# EAGLE design circuit0 (EAGLE 9.6.2)
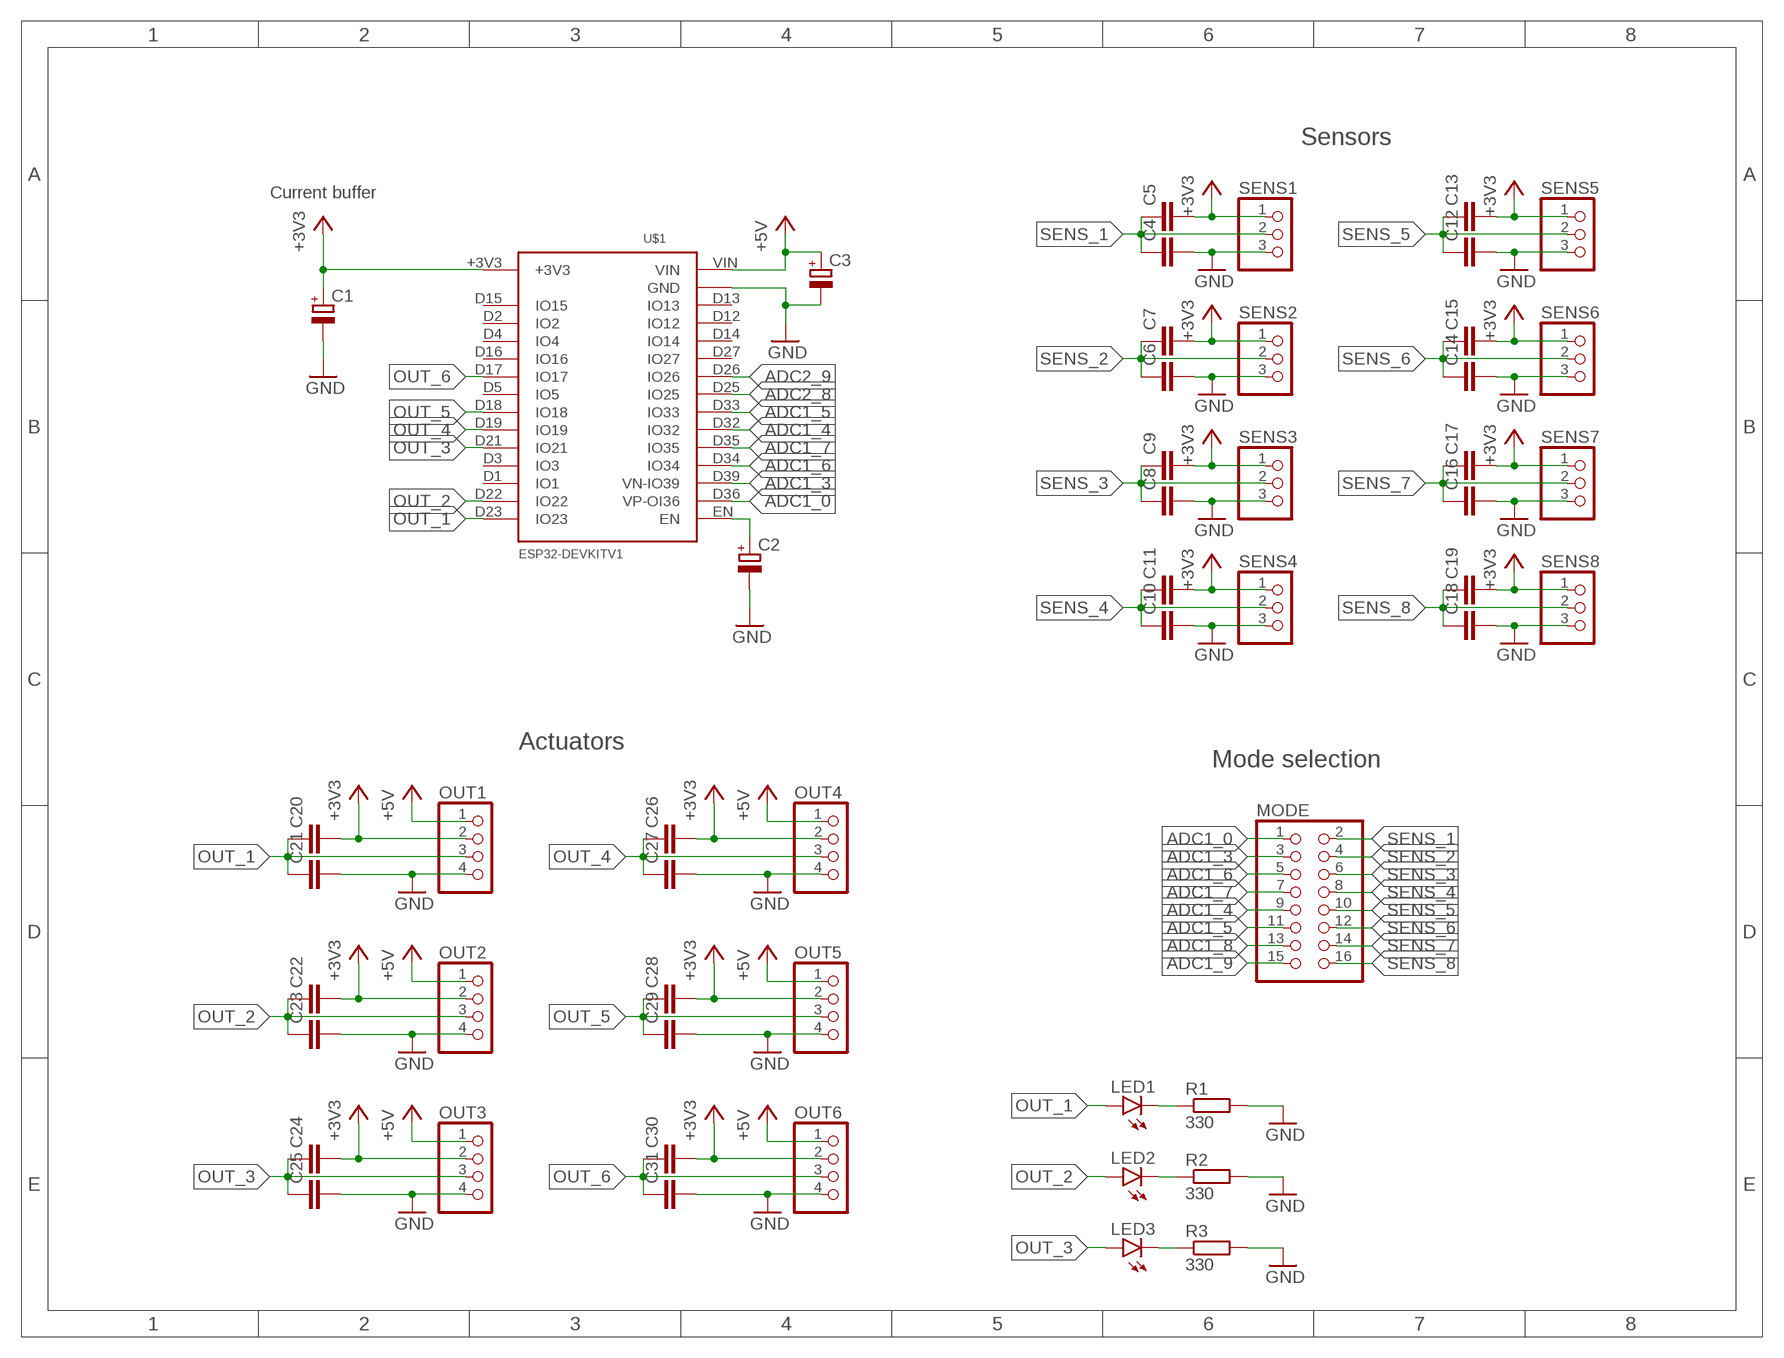
[diagram p0: schematic, sheet 1]

## Parts
C1  CPOL-EUE3.5-8  [E3,5-8]
C2  CPOL-EUE3.5-8  [E3,5-8]
C3  CPOL-EUE3.5-8  [E3,5-8]
C4  C-EU025-030X050  [C025-030X050]
C5  C-EU025-030X050  [C025-030X050]
C6  C-EU025-030X050  [C025-030X050]
C7  C-EU025-030X050  [C025-030X050]
C8  C-EU025-030X050  [C025-030X050]
C9  C-EU025-030X050  [C025-030X050]
C10  C-EU025-030X050  [C025-030X050]
C11  C-EU025-030X050  [C025-030X050]
C12  C-EU025-030X050  [C025-030X050]
C13  C-EU025-030X050  [C025-030X050]
C14  C-EU025-030X050  [C025-030X050]
C15  C-EU025-030X050  [C025-030X050]
C16  C-EU025-030X050  [C025-030X050]
C17  C-EU025-030X050  [C025-030X050]
C18  C-EU025-030X050  [C025-030X050]
C19  C-EU025-030X050  [C025-030X050]
C20  C-EU025-030X050  [C025-030X050]
C21  C-EU025-030X050  [C025-030X050]
C22  C-EU025-030X050  [C025-030X050]
C23  C-EU025-030X050  [C025-030X050]
C24  C-EU025-030X050  [C025-030X050]
C25  C-EU025-030X050  [C025-030X050]
C26  C-EU025-030X050  [C025-030X050]
C27  C-EU025-030X050  [C025-030X050]
C28  C-EU025-030X050  [C025-030X050]
C29  C-EU025-030X050  [C025-030X050]
C30  C-EU025-030X050  [C025-030X050]
C31  C-EU025-030X050  [C025-030X050]
LED1  LED3MM  [LED3MM]
LED2  LED3MM  [LED3MM]
LED3  LED3MM  [LED3MM]
MODE  PINHD-2X8  [2X08]
OUT1  PINHD-1X4  [1X04]
OUT2  PINHD-1X4  [1X04]
OUT3  PINHD-1X4  [1X04]
OUT4  PINHD-1X4  [1X04]
OUT5  PINHD-1X4  [1X04]
OUT6  PINHD-1X4  [1X04]
R1  330  R-EU_0204/7  [0204/7]
R2  330  R-EU_0204/7  [0204/7]
R3  330  R-EU_0204/7  [0204/7]
SENS1  PINHD-1X3  [1X03]
SENS2  PINHD-1X3  [1X03]
SENS3  PINHD-1X3  [1X03]
SENS4  PINHD-1X3  [1X03]
SENS5  PINHD-1X3  [1X03]
SENS6  PINHD-1X3  [1X03]
SENS7  PINHD-1X3  [1X03]
SENS8  PINHD-1X3  [1X03]
U$1  ESP32DEVKITV1  [ESP32-DEVKITV1]

## Nets
+3V3: C1.+ C5.2 C7.2 C9.2 C11.2 C13.2 C15.2 C17.2 C19.2 C20.2 C22.2 C24.2 C26.2 C28.2 C30.2 OUT1.2 OUT2.2 OUT3.2 OUT4.2 OUT5.2 OUT6.2 SENS1.1 SENS2.1 SENS3.1 SENS4.1 SENS5.1 SENS6.1 SENS7.1 SENS8.1 U$1.+3V3
+5V: C3.+ OUT1.1 OUT2.1 OUT3.1 OUT4.1 OUT5.1 OUT6.1 U$1.VIN
ADC1_0: MODE.1 U$1.D36(VP-OI36)
ADC1_3: MODE.3 U$1.D39(VN-IO39)
ADC1_4: MODE.9 U$1.D32(IO32)
ADC1_5: MODE.11 U$1.D33(IO33)
ADC1_6: MODE.5 U$1.D34(IO34)
ADC1_7: MODE.7 U$1.D35(IO35)
ADC1_8: MODE.13
ADC1_9: MODE.15
ADC2_8: U$1.D25(IO25)
ADC2_9: U$1.D26(IO26)
GND: C1.- C2.- C3.- C4.2 C6.2 C8.2 C10.2 C12.2 C14.2 C16.2 C18.2 C21.2 C23.2 C25.2 C27.2 C29.2 C31.2 OUT1.4 OUT2.4 OUT3.4 OUT4.4 OUT5.4 OUT6.4 R1.2 R2.2 R3.2 SENS1.3 SENS2.3 SENS3.3 SENS4.3 SENS5.3 SENS6.3 SENS7.3 SENS8.3 U$1.GND U$1.GND@2(GND)
N$1: C2.+ U$1.EN
N$2: LED1.K(C) R1.1
N$3: LED2.K(C) R2.1
N$4: LED3.K(C) R3.1
OUT_1: C20.1 C21.1 LED1.A OUT1.3 U$1.D23(IO23)
OUT_2: C22.1 C23.1 LED2.A OUT2.3 U$1.D22(IO22)
OUT_3: C24.1 C25.1 LED3.A OUT3.3 U$1.D21(IO21)
OUT_4: C26.1 C27.1 OUT4.3 U$1.D19(IO19)
OUT_5: C28.1 C29.1 OUT5.3 U$1.D18(IO18)
OUT_6: C30.1 C31.1 OUT6.3 U$1.D17(IO17)
SENS_1: C4.1 C5.1 MODE.2 SENS1.2
SENS_2: C6.1 C7.1 MODE.4 SENS2.2
SENS_3: C8.1 C9.1 MODE.6 SENS3.2
SENS_4: C10.1 C11.1 MODE.8 SENS4.2
SENS_5: C12.1 C13.1 MODE.10 SENS5.2
SENS_6: C14.1 C15.1 MODE.12 SENS6.2
SENS_7: C16.1 C17.1 MODE.14 SENS7.2
SENS_8: C18.1 C19.1 MODE.16 SENS8.2
Unconnected: U$1.D1(IO1) U$1.D2(IO2) U$1.D3(IO3) U$1.D4(IO4) U$1.D5(IO5) U$1.D12(IO12) U$1.D13(IO13) U$1.D14(IO14) U$1.D15(IO15) U$1.D16(IO16) U$1.D27(IO27)

## Notes on the sheet
- Sensors
- Current buffer
- Actuators
- Mode selection

## Library data of the parts
C1-C3 = rcl:CPOL-EU: POLARIZED CAPACITOR, European symbol; SPICEPREFIX: C
C4-C31 = rcl:C-EU: CAPACITOR, European symbol; SPICEPREFIX: C
LED1-LED3 = led:LED: LED OSRAM: - CHIPLED LG R971, LG N971, LY N971, LG Q971, LY Q971, LO R971, LY R971 LH N974, LH R974 LS Q976, LO Q976, LY Q976 LO Q996 - Hyper CHIPLED LW Q18S LB Q993, LB Q99A, LB R99A - SideLED LS A670, LO A670, LY A670, LG A670, LP A670 LB A673, LV A673, LT A673, LW A673 LH A674 LY A675 LS A676, LA A676, LO A676, LY A676, LW A676 LS A679, LY A679, LG A679 - Hyper Micro SIDELED® LS Y876, LA Y876, LO Y876, LY Y876 LT Y87S - SmartLED LW L88C, LW L88S LB L89C, LB L89S, LG L890 LS L89K, LO L89K, LY L89K LS L896, LA L896, LO L896, LY L896 - TOPLED LS T670, LO T670, LY T670, LG T670, LP T670 LSG T670, LSP T670, LSY T670, LOP T670, LYG T670 LG T671, LOG T671, LSG T671 LB T673, LV T673, LT T673, LW T673 LH T674 LS T676, LA T676, LO T676, LY T676, LB T676, LH T676, LSB T676, LW T676 LB T67C, LV T67C, LT T67C, LS T67K, LO T67K, LY T67K, LW E67C LS E67B, LA E67B, LO E67B, LY E67B, LB E67C, LV E67C, LT E67C LW T67C LS T679, LY T679, LG T679 LS T770, LO T770, LY T770, LG T770, LP T770 LB T773, LV T773, LT T773, LW T773 LH T774 LS E675, LA E675, LY E675, LS T675 LS T776, LA T776, LO T776, LY T776, LB T776 LHGB T686 LT T68C, LB T68C - Hyper Mini TOPLED® LB M676 - Mini TOPLED Santana® LG M470 LS M47K, LO M47K, LY M47K Source: http://www.osram.convergy.de LUXEON: - LUMILED® LXK2-PW12-R00, LXK2-PW12-S00, LXK2-PW14-U00, LXK2-PW14-V00 LXK2-PM12-R00, LXK2-PM12-S00, LXK2-PM14-U00 LXK2-PE12-Q00, LXK2-PE12-R00, LXK2-PE12-S00, LXK2-PE14-T00, LXK2-PE14-U00 LXK2-PB12-K00, LXK2-PB12-L00, LXK2-PB12-M00, LXK2-PB14-N00, LXK2-PB14-P00, LXK2-PB14-Q00 LXK2-PR12-L00, LXK2-PR12-M00, LXK2-PR14-Q00, LXK2-PR14-R00 LXK2-PD12-Q00, LXK2-PD12-R00, LXK2-PD12-S00 LXK2-PH12-R00, LXK2-PH12-S00 LXK2-PL12-P00, LXK2-PL12-Q00, LXK2-PL12-R00 Source: www.luxeon.com KINGBRIGHT: KA-3528ASYC Source: www.kingbright.com
MODE = pinhead:PINHD-2X8: PIN HEADER
OUT1-OUT6 = pinhead:PINHD-1X4: PIN HEADER
R1-R3 = rcl:R-EU_: RESISTOR, European symbol; SPICEPREFIX: R
SENS1-SENS8 = pinhead:PINHD-1X3: PIN HEADER
U$1 = samuel:ESP32DEVKITV1

## Board
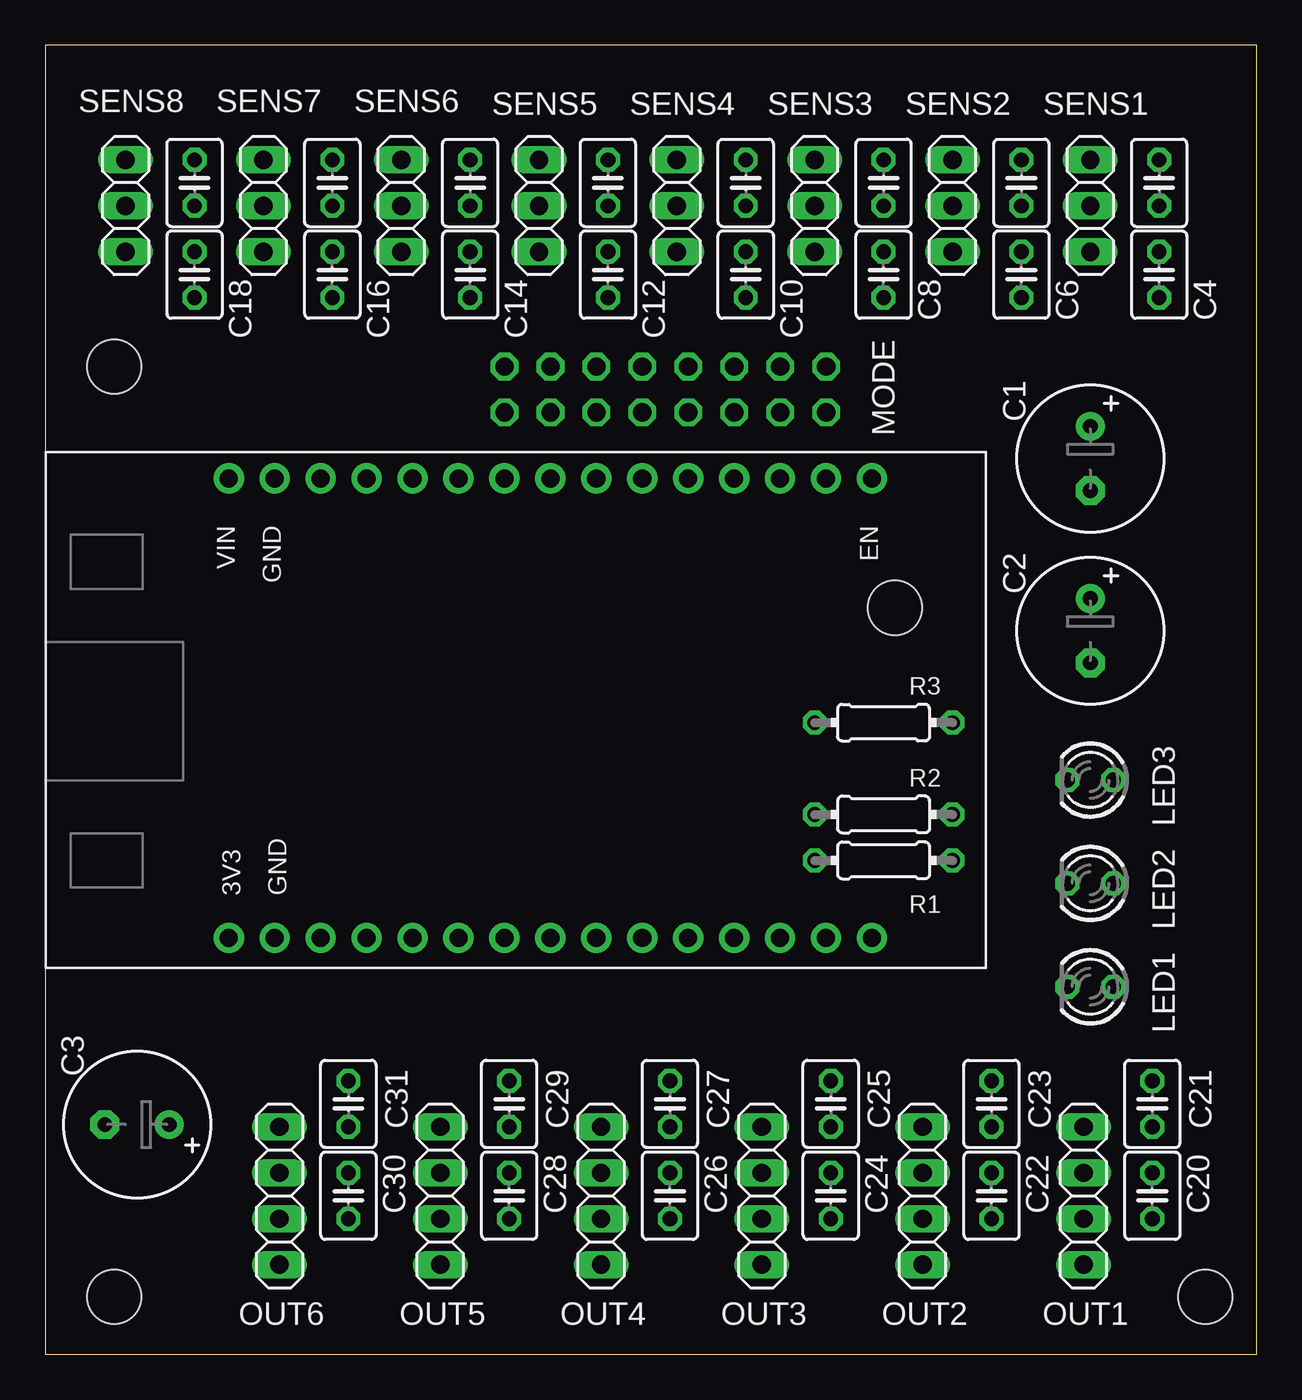
[diagram p1: board, top side]
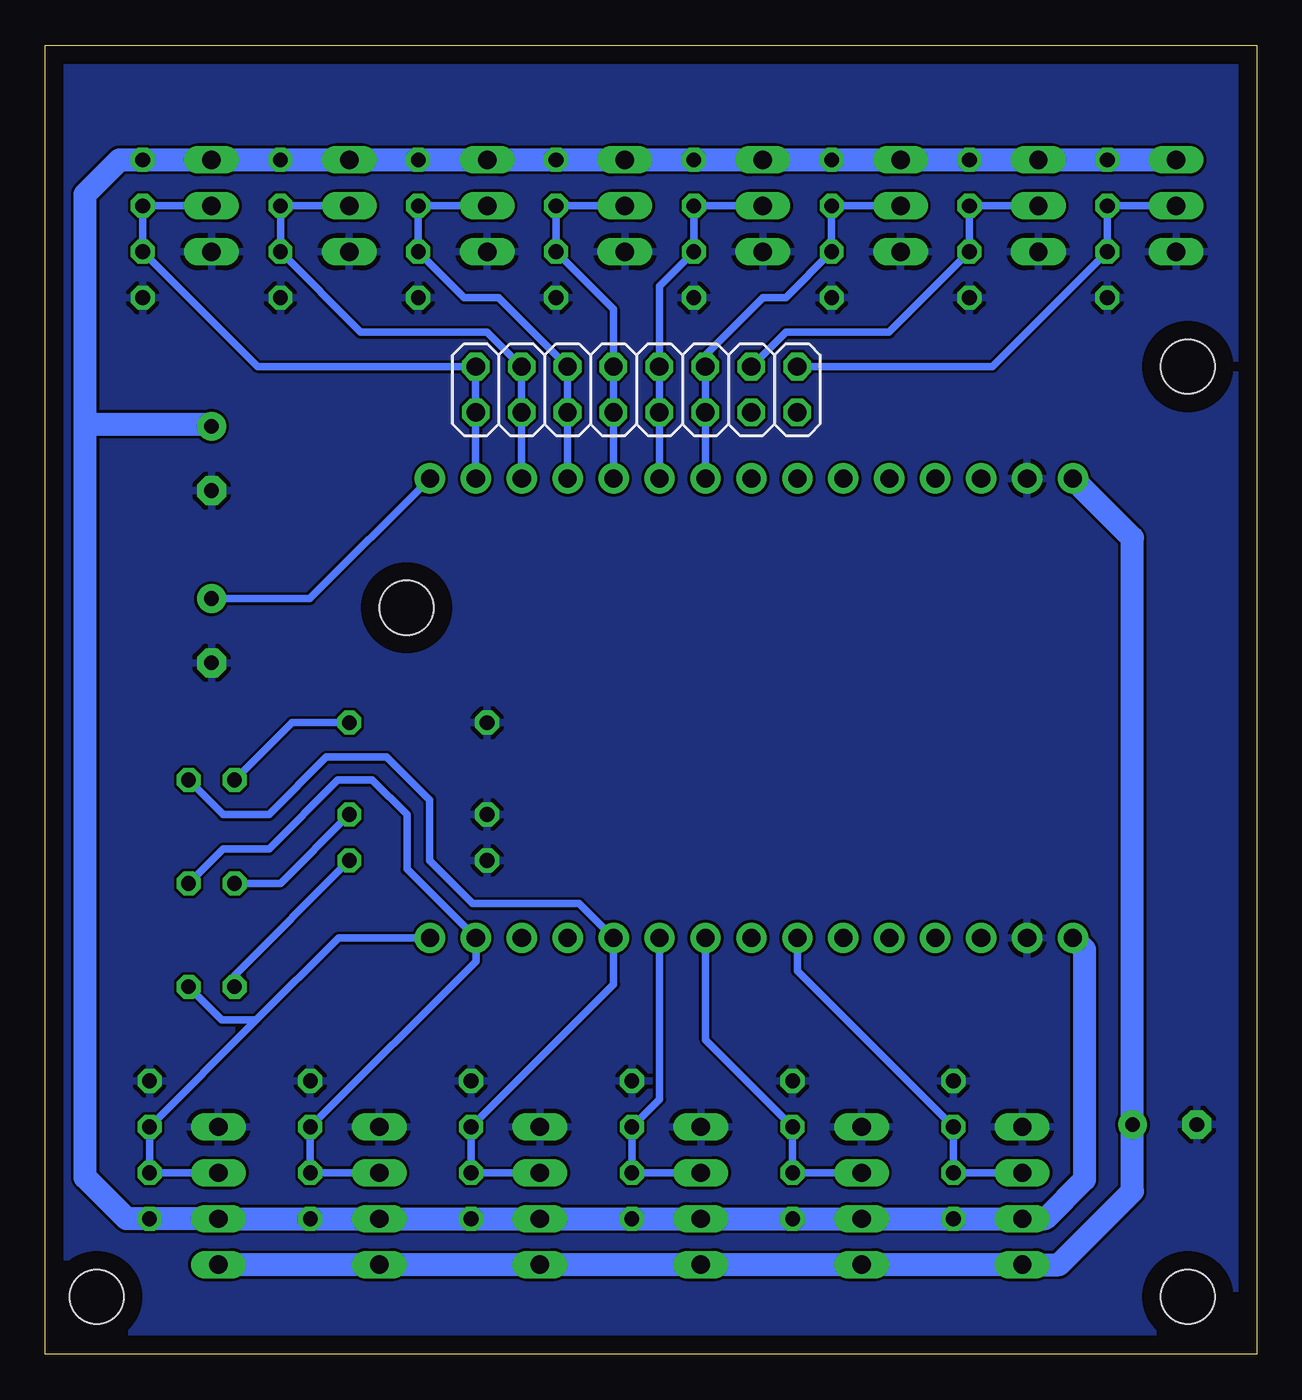
[diagram p2: board, bottom side, seen from below]

Size 66.98 x 72.38 mm. Coordinates in mm from the lower left corner, seen from the top.
Outline: 0,0 66.98,0 66.98,72.38 0,72.38 0,0
Copper layers (1*16): Top 0.035mm / dielectric 1.5mm / Bottom 0.035mm
Design rules "default": minimum track width 6mil, minimum drill 0.35mm, track to track 6mil, track to pad 6mil, pad to pad 6mil, via to via 6mil, smd to smd 6mil, copper to edge 40mil, drill to drill 6mil, minimum pad ring 10mil, minimum via ring 8mil, stop-mask expansion 4mil, vias tented up to drill 0mil, thermal gap 10mil
Holes 3 mm at 64.14,3.18 3.81,3.18 3.81,54.61 46.99,41.27

### Footprints (pad centres in the part's own frame; a part is rotated, then mirrored left to right if it is on the bottom)
E3,5-8 = drill 0.813 pad 1.6: + -1.778,0 | drill 0.813 pad 1.6 octagon: - 1.778,0
C025-030X050 = drill 0.813 octagon: 1 -1.27,0; 2 1.27,0
LED3MM = drill 0.813 octagon: A -1.27,0; K 1.27,0
2X08 = drill 1.016 octagon: 1 -8.89,-1.27; 2 -8.89,1.27; 3 -6.35,-1.27; 4 -6.35,1.27; 5 -3.81,-1.27; 6 -3.81,1.27; 7 -1.27,-1.27; 8 -1.27,1.27; 9 1.27,-1.27; 10 1.27,1.27; 11 3.81,-1.27; 12 3.81,1.27; 13 6.35,-1.27; 14 6.35,1.27; 15 8.89,-1.27; 16 8.89,1.27
1X04 = drill 1.016 long: 1 -3.81,0; 2 -1.27,0; 3 1.27,0; 4 3.81,0
0204/7 = drill 0.813 octagon: 1 -3.81,0; 2 3.81,0
1X03 = drill 1.016 long: 1 -2.54,0; 2 0,0; 3 2.54,0
ESP32-DEVKITV1 = drill 1 pad 1.676: +3V3 -15.25,-12.54; D1 15.23,-12.54; D2 -7.63,-12.54; D3 12.69,-12.54; D4 -5.09,-12.54; D5 2.53,-12.54; D12 -7.63,12.865; D13 -10.17,12.865; D14 -5.09,12.865; D15 -10.17,-12.54; D16 -2.55,-12.54; D17 -0.01,-12.54; D18 5.07,-12.54; D19 7.61,-12.54; D21 10.15,-12.54; D22 17.77,-12.54; D23 20.31,-12.54; D25 2.53,12.865; D26 -0.01,12.865; D27 -2.55,12.865; D32 7.61,12.865; D33 5.07,12.865; D34 12.69,12.865; D35 10.15,12.865; D36 17.77,12.865; D39 15.23,12.865; EN 20.31,12.865; GND -12.71,12.865; GND@2 -12.71,-12.54; VIN -15.25,12.865

### Placement (x,y rotation side)
C1  57.78,49.53 270 top
C2  57.78,40 270 top
C3  5.08,12.7 180 top
C4  61.59,59.69 270 top
C5  61.59,64.77 90 top
C6  53.98,59.69 270 top
C7  53.98,64.77 90 top
C8  46.35,59.69 270 top
C9  46.35,64.77 90 top
C10  38.73,59.69 270 top
C11  38.73,64.77 90 top
C12  31.12,59.69 270 top
C13  31.12,64.77 90 top
C14  23.49,59.69 270 top
C15  23.49,64.77 90 top
C16  15.88,59.69 270 top
C17  15.88,64.77 90 top
C18  8.26,59.69 270 top
C19  8.26,64.77 90 top
C20  61.21,8.76 270 top
C21  61.21,13.84 90 top
C22  52.32,8.76 270 top
C23  52.32,13.84 90 top
C24  43.43,8.76 270 top
C25  43.43,13.84 90 top
C26  34.54,8.76 270 top
C27  34.54,13.84 90 top
C28  25.65,8.76 270 top
C29  25.65,13.84 90 top
C30  16.76,8.76 270 top
C31  16.76,13.84 90 top
LED1  57.78,20.32 180 top
LED2  57.78,26.03 180 top
LED3  57.78,31.75 180 top
MODE  34.29,53.34 0 bottom
OUT1  57.4,8.76 90 top
OUT2  48.51,8.76 90 top
OUT3  39.62,8.76 90 top
OUT4  30.73,8.76 90 top
OUT5  21.84,8.76 90 top
OUT6  12.95,8.76 90 top
R1  46.35,27.3 180 top
R2  46.35,29.84 180 top
R3  46.35,34.92 180 top
SENS1  57.78,63.5 270 top
SENS2  50.16,63.5 270 top
SENS3  42.55,63.5 270 top
SENS4  34.92,63.5 270 top
SENS5  27.3,63.5 270 top
SENS6  19.68,63.5 270 top
SENS7  12.07,63.5 270 top
SENS8  4.44,63.5 270 top
U$1  25.4,35.56 0 top

### Tracks (layer width: path | path; a pad name or v marks a point on that pad's centre or on a via)
+3V3
  Bottom 1.27: SENS8.1 C19.2 SENS7.1 C17.2 SENS6.1 C15.2 SENS5.1 C13.2 SENS4.1 C11.2 SENS3.1 C9.2 SENS2.1 C7.2 SENS1.1 C5.2 62.86,66.04 64.77,64.14 64.77,51.43 | U$1.+3V3 9.52,22.38 9.52,9.66 11.68,7.49 OUT6.2 C30.2 OUT5.2 C28.2 OUT4.2 C26.2 OUT3.2 C24.2 OUT2.2 C22.2 OUT1.2 C20.2 62.48,7.49 64.77,9.78 64.77,51.43 | C1.+ 57.91,51.43 64.77,51.43
+5V
  Bottom 1.27: OUT1.1 OUT2.1 OUT3.1 OUT4.1 OUT5.1 OUT6.1 10.92,4.95 6.86,9.02 C3.+ 6.86,45.13 U$1.VIN
ADC1_0
  Bottom 0.406: U$1.D36 43.18,48.43 MODE.1 43.18,54.61
ADC1_3
  Bottom 0.406: U$1.D39 40.63,52.06 MODE.3 40.64,54.61
ADC1_4
  Bottom 0.406: U$1.D32 33.02,48.43 MODE.9 33.02,54.61
ADC1_5
  Bottom 0.406: U$1.D33 30.48,48.43 MODE.11 30.48,54.61
ADC1_6
  Bottom 0.406: U$1.D34 38.1,48.43 MODE.5 38.1,54.61
ADC1_7
  Bottom 0.406: U$1.D35 35.56,48.43 MODE.7 35.56,54.61
GND
  pour Bottom (isolate 0.152): -1.91,78.74 71.75,78.74 71.75,-6.35 -1.91,-6.35
N$1
  Bottom 0.406: C2.+ 52.35,41.78 U$1.EN
N$2
  Bottom 0.406: R1.1 56.52,20.95 LED1.K
N$3
  Bottom 0.406: LED2.K 53.98,26.03 R2.1
N$4
  Bottom 0.406: LED3.K 53.34,34.92 R3.1
OUT_1
  Bottom 0.406: OUT1.3 C20.1 C21.1 55.31,18.48 | 55.31,18.48 50.77,23.02 U$1.D23 | LED1.A 57.21,18.48 55.31,18.48
OUT_2
  Bottom 0.406: OUT2.3 C22.1 C23.1 43.17,21.73 U$1.D22 46.98,26.83 46.98,29.84 48.89,31.75 50.8,31.75 54.61,27.94 57.15,27.94 LED2.A
OUT_3
  Bottom 0.406: OUT3.3 C24.1 C25.1 35.55,20.46 U$1.D21 37.45,24.92 43.34,24.92 45.72,27.3 45.72,30.65 48.09,33.02 51.44,33.02 54.61,29.84 57.15,29.84 LED3.A
OUT_4
  Bottom 0.406: OUT4.3 C26.1 C27.1 33.01,14.11 U$1.D19
OUT_5
  Bottom 0.406: OUT5.3 C28.1 C29.1 30.47,17.39 U$1.D18
OUT_6
  Bottom 0.406: OUT6.3 C30.1 C31.1 25.39,21.2 U$1.D17
SENS_1
  Bottom 0.406: SENS1.2 C5.1 C4.1 55.24,54.61 MODE.2
SENS_2
  Bottom 0.406: SENS2.2 C7.1 C6.1 49.53,56.52 42.55,56.52 MODE.4
SENS_3
  Bottom 0.406: SENS3.2 C9.1 C8.1 43.81,58.42 41.91,58.42 MODE.6
SENS_4
  Bottom 0.406: SENS4.2 C11.1 C10.1 35.56,57.79 MODE.8
SENS_5
  Bottom 0.406: SENS5.2 C13.1 C12.1 33.02,59.05 MODE.10
SENS_6
  Bottom 0.406: SENS6.2 C15.1 C14.1 26.04,58.42 27.3,58.42 30.48,55.24 MODE.12
SENS_7
  Bottom 0.406: SENS7.2 C17.1 C16.1 20.32,56.52 26.04,56.52 MODE.14
SENS_8
  Bottom 0.406: SENS8.2 C19.1 C18.1 14.61,54.61 MODE.16